# Altium schematic sheet etapa1_anger_X.SchDoc
size A4
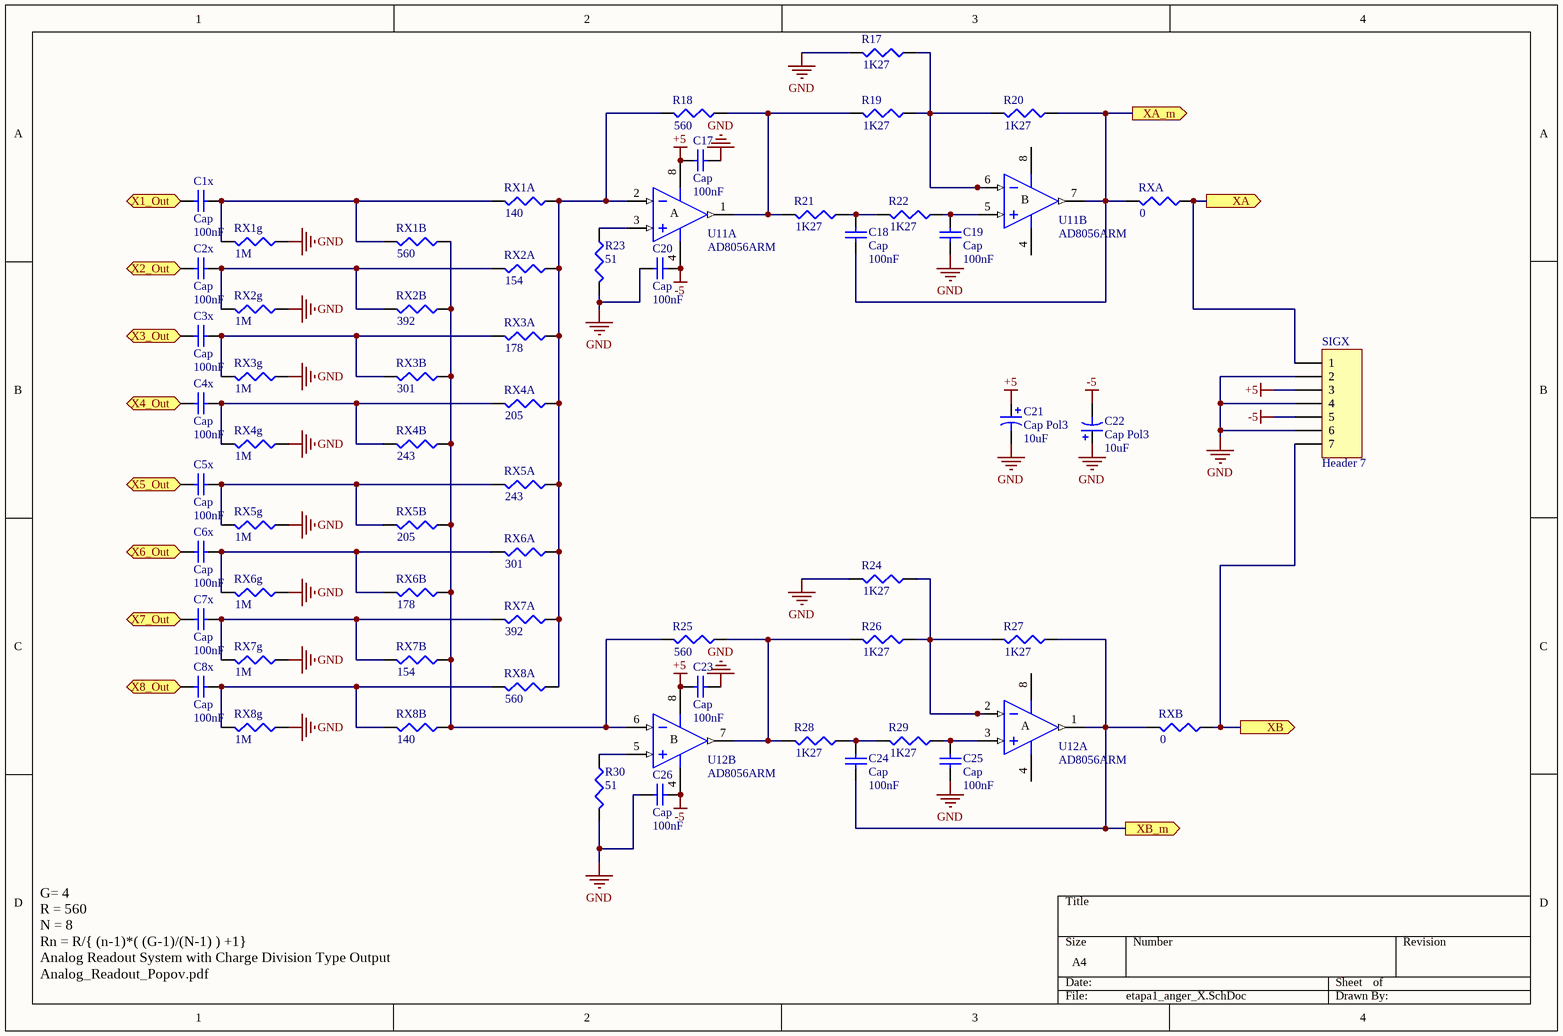
[diagram p0: etapa1_anger_X.SchDoc]

## Parts
C1x  Cap  value 100nF  [1608[0603]]
C2x  Cap  value 100nF  [1608[0603]]
C3x  Cap  value 100nF  [1608[0603]]
C4x  Cap  value 100nF  [1608[0603]]
C5x  Cap  value 100nF  [1608[0603]]
C6x  Cap  value 100nF  [1608[0603]]
C7x  Cap  value 100nF  [1608[0603]]
C8x  Cap  value 100nF  [1608[0603]]
C17  Cap  value 100nF  [1608[0603]]
C18  Cap  value 100nF  [1608[0603]]
C19  Cap  value 100nF  [1608[0603]]
C20  Cap  value 100nF  [1608[0603]]
C21  Cap Pol3  value 10uF  [C0805]
C22  Cap Pol3  value 10uF  [C0805]
C23  Cap  value 100nF  [1608[0603]]
C24  Cap  value 100nF  [1608[0603]]
C25  Cap  value 100nF  [1608[0603]]
C26  Cap  value 100nF  [1608[0603]]
R17  value 1K27  [1608[0603]]  (hidden comment: Res3)
R18  value 560  [0402]  (hidden comment: Res3)
R19  value 1K27  [0402]  (hidden comment: Res3)
R20  value 1K27  [0402]  (hidden comment: Res3)
R21  value 1K27  [0402]  (hidden comment: Res3)
R22  value 1K27  [0402]  (hidden comment: Res3)
R23  value 51  [0402]  (hidden comment: Res3)
R24  value 1K27  [1608[0603]]  (hidden comment: Res3)
R25  value 560  [0402]  (hidden comment: Res3)
R26  value 1K27  [0402]  (hidden comment: Res3)
R27  value 1K27  [0402]  (hidden comment: Res3)
R28  value 1K27  [0402]  (hidden comment: Res3)
R29  value 1K27  [0402]  (hidden comment: Res3)
R30  value 51  [0402]  (hidden comment: Res3)
RX1A  value 140  [0402]  (hidden comment: Res3)
RX1B  value 560  [0402]  (hidden comment: Res3)
RX1g  value 1M  [J1-0603]  (hidden comment: Res3)
RX2A  value 154  [0402]  (hidden comment: Res3)
RX2B  value 392  [0402]  (hidden comment: Res3)
RX2g  value 1M  [J1-0603]  (hidden comment: Res3)
RX3A  value 178  [0402]  (hidden comment: Res3)
RX3B  value 301  [0402]  (hidden comment: Res3)
RX3g  value 1M  [J1-0603]  (hidden comment: Res3)
RX4A  value 205  [0402]  (hidden comment: Res3)
RX4B  value 243  [0402]  (hidden comment: Res3)
RX4g  value 1M  [J1-0603]  (hidden comment: Res3)
RX5A  value 243  [0402]  (hidden comment: Res3)
RX5B  value 205  [0402]  (hidden comment: Res3)
RX5g  value 1M  [J1-0603]  (hidden comment: Res3)
RX6A  value 301  [0402]  (hidden comment: Res3)
RX6B  value 178  [0402]  (hidden comment: Res3)
RX6g  value 1M  [J1-0603]  (hidden comment: Res3)
RX7A  value 392  [0402]  (hidden comment: Res3)
RX7B  value 154  [0402]  (hidden comment: Res3)
RX7g  value 1M  [J1-0603]  (hidden comment: Res3)
RX8A  value 560  [0402]  (hidden comment: Res3)
RX8B  value 140  [0402]  (hidden comment: Res3)
RX8g  value 1M  [J1-0603]  (hidden comment: Res3)
RXA  value 0  [0402]  (hidden comment: Res3)
RXB  value 0  [0402]  (hidden comment: Res3)
SIGX  Header 7  [HDR1X7]
U11  AD8056ARM  [RM-8]  (parts A,B of 2)
U12  AD8056ARM  [RM-8]  (parts A,B of 2)

## Ports
X1_Out (out), X2_Out (out), X3_Out (out), X4_Out (out), X5_Out (out), X6_Out (out), X7_Out (out), X8_Out (out), XA (out), XA_m (out), XB (out), XB_m (out)

## Nets
+5: C17.1 C21.1 C23.1 SIGX.3 U11.8(V+) U12.8(V+)
-5: C20.2 C22.2 C26.2 SIGX.5 U11.4(V-) U12.4(V-)
GND: C17.2 C19.2 C20.1 C21.2 C22.1 C23.2 C25.2 C26.1 R17.2 R23.2 R24.2 R30.2 RX1g.1 RX2g.1 RX3g.1 RX4g.1 RX5g.1 RX6g.1 RX7g.1 RX8g.1 SIGX.2 SIGX.4 SIGX.6
X1_Out: C1x.1 ; port X1_Out
X2_Out: C2x.1 ; port X2_Out
X3_Out: C3x.1 ; port X3_Out
X4_Out: C4x.1 ; port X4_Out
X5_Out: C5x.1 ; port X5_Out
X6_Out: C6x.1 ; port X6_Out
X7_Out: C7x.1 ; port X7_Out
X8_Out: C8x.1 ; port X8_Out
XA: RXA.1 SIGX.1 ; port XA
XA_m: C18.2 R20.1 RXA.2 U11.7(OUT) ; port XA_m
XB: RXB.1 SIGX.7 ; port XB
XB_m: C24.2 R27.1 RXB.2 U12.1(OUT) ; port XB_m
NetC1x_2: C1x.2 RX1A.2 RX1B.2 RX1g.2
NetC2x_2: C2x.2 RX2A.2 RX2B.2 RX2g.2
NetC3x_2: C3x.2 RX3A.2 RX3B.2 RX3g.2
NetC4x_2: C4x.2 RX4A.2 RX4B.2 RX4g.2
NetC5x_2: C5x.2 RX5A.2 RX5B.2 RX5g.2
NetC6x_2: C6x.2 RX6A.2 RX6B.2 RX6g.2
NetC7x_2: C7x.2 RX7A.2 RX7B.2 RX7g.2
NetC8x_2: C8x.2 RX8A.2 RX8B.2 RX8g.2
NetC18_1: C18.1 R21.1 R22.2
NetC19_1: C19.1 R22.1 U11.5(IN+)
NetC24_1: C24.1 R28.1 R29.2
NetC25_1: C25.1 R29.1 U12.3(IN+)
NetR17_1: R17.1 R19.1 R20.2 U11.6(IN-)
NetR18_1: R18.1 R19.2 R21.2 U11.1(OUT)
NetR18_2: R18.2 RX1A.1 RX2A.1 RX3A.1 RX4A.1 RX5A.1 RX6A.1 RX7A.1 RX8A.1 U11.2(IN-)
NetR23_1: R23.1 U11.3(IN+)
NetR24_1: R24.1 R26.1 R27.2 U12.2(IN-)
NetR25_1: R25.1 R26.2 R28.2 U12.7(OUT)
NetR25_2: R25.2 RX1B.1 RX2B.1 RX3B.1 RX4B.1 RX5B.1 RX6B.1 RX7B.1 RX8B.1 U12.6(IN-)
NetR30_1: R30.1 U12.5(IN+)

## Notes on the sheet
- G= 4
  R = 560
  N = 8
  Rn = R/{ (n-1)*( (G-1)/(N-1) ) +1}
  Analog Readout System with Charge Division Type Output
  Analog_Readout_Popov.pdf
- (in symbol AD8056ARM, part A) A
- (in symbol AD8056ARM, part B) B

## Library data of the parts
C1x C2x C3x C4x C5x C6x C7x C8x C17-C20 C23-C26 = Cap: Capacitor; Published: 8-Jun-2000; LatestRevisionDate: 17-Jul-2002; LatestRevisionNote: Re-released for DXP Platform.; PackageReference: RAD-0.3; Publisher: Altium Limited; PackageDescription: Radial Cap, Thru-Hole; 2 Leads; 0.3 in Pin Spacing
C21 C22 = Cap Pol3: Polarized Capacitor (Surface Mount); Published: 8-Jun-2000; LatestRevisionDate: 29-May-2009; LatestRevisionNote: IPC-7351 Footprint Added.; PackageReference: C0805; Publisher: Altium Limited; PackageDescription: Chip Capacitor
R17-R30 RX1A RX1B RX1g RX2A RX2B RX2g RX3A RX3B RX3g RX4A RX4B RX4g RX5A RX5B RX5g RX6A RX6B RX6g RX7A RX7B RX7g RX8A RX8B RX8g RXA RXB = Res3: Resistor; Published: 8-Jun-2000; LatestRevisionDate: 29-May-2009; LatestRevisionNote: IPC-7351 Footprint Added.; PackageReference: J1-0603; Publisher: Altium Limited; PackageDescription: Chip Resistor
SIGX = Header 7: Header, 7-Pin; LatestRevisionDate: 17-Jul-2002; LatestRevisionNote: Re-released for DXP Platform.; Publisher: Altium Limited
U11 U12 = AD8056ARM: Low Cost, 300MHz Voltage Feedback Amplifier; Published: 8-Jun-2000; LatestRevisionDate: 04-Mar-2005; LatestRevisionNote: Stylized 3D Model Added, PCB footprint pad width decreased.; DatasheetVersion: REV. 0 1997; PackageVersion: 2004; PackageReference: RM-8; Publisher: Altium Limited; PackageDescription: Shrink Small Outline, MSOP; 8 Leads; Body Width 3 mm; Pitch 0.65 mm; Code_JEDEC: MO-187-AA; ComponentLink1Description: Manufacturer Link; ComponentLink1URL: http://www.analog.com/en/prod/0,,759_786_AD8055%2C00.html; ComponentLink2Description: Datasheet; ComponentLink2URL: http://www.analog.com/UploadedFiles/Data_Sheets/40402558757264AD8055_6_i.pdf